# EasyEDA schematic SCH_Moses-Mini_2025-01-24.json
TITLE: Sheet_1; REV: 1.0; Date: 2025-01-20; Sheet: 1/1; Drawn By: augiekweston; Company: Your Company
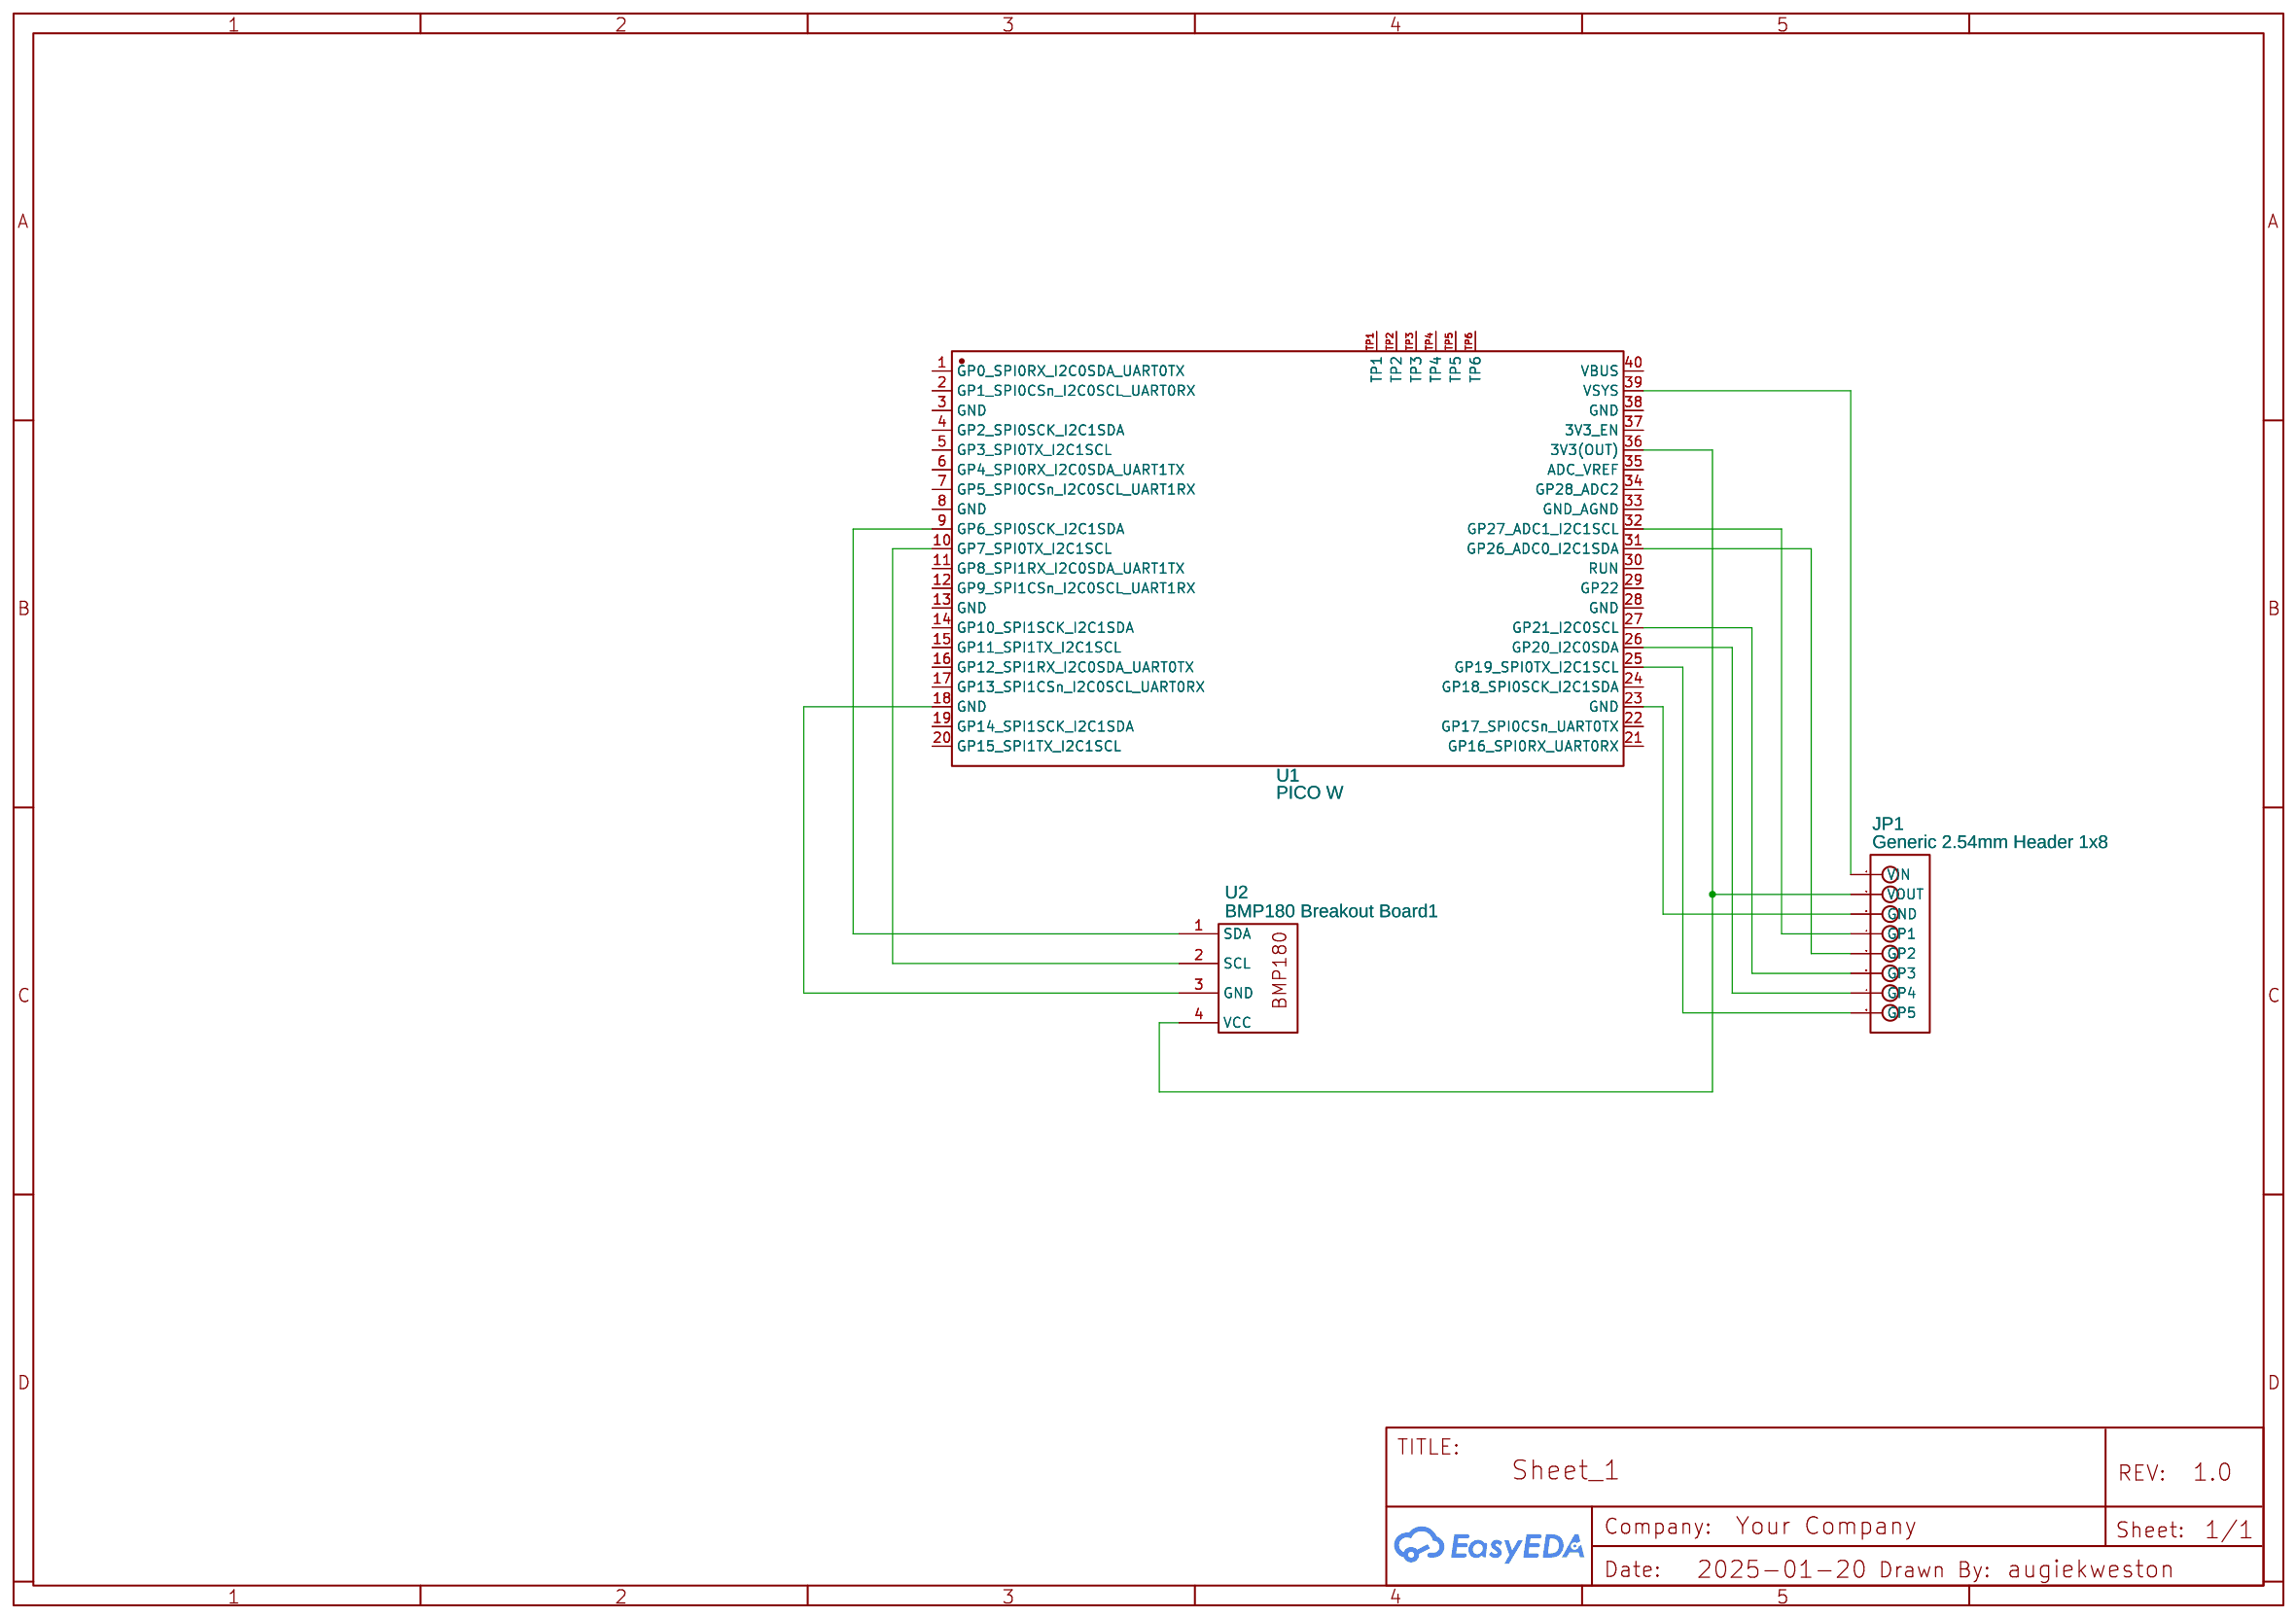
[diagram p0: schematic sheet]

## Parts
JP1  Generic 2.54mm Header 1x8  [GENERIC 2.54MM HEADER 1X8]
U1  PICO W  [COMM-SMD_L51.0-W21.0-P2.54_PICOW]
U2  BMP180 Breakout Board1  [BMP180]

## Library data of the parts
JP1 = Generic 2.54mm Header 1x8: Contributor: danagould
U1 = PICO W: Supplier: LCSC; Supplier Part: C7203003; Manufacturer: Raspberry Pi(树莓派); Contributor: lcsc; JLCPCB Part Class: Extended Part
U2 = BMP180 Breakout Board1: Contributor: Melone44

## Nets
Net-(JP1-1): JP1.1(VIN) U1.39(VSYS)
Net-(JP1-2): JP1.2(VOUT) U1.36(3V3(OUT)) U2.4(VCC)
Net-(JP1-3): JP1.3(GND) U1.23(GND)
Net-(JP1-4): JP1.4(GP1) U1.32(GP27_ADC1_I2C1SCL)
Net-(JP1-5): JP1.5(GP2) U1.31(GP26_ADC0_I2C1SDA)
Net-(JP1-6): JP1.6(GP3) U1.27(GP21_I2C0SCL)
Net-(JP1-7): JP1.7(GP4) U1.26(GP20_I2C0SDA)
Net-(JP1-8): JP1.8(GP5) U1.25(GP19_SPI0TX_I2C1SCL)
Net-(U1-9): U1.9(GP6_SPI0SCK_I2C1SDA) U2.1(SDA)
Net-(U1-10): U1.10(GP7_SPI0TX_I2C1SCL) U2.2(SCL)
Net-(U1-18): U1.18(GND) U2.3(GND)

Not connected (* = marked no-connect by the designer): U1 1(GP0_SPI0RX_I2C0SDA_UART0TX) 2(GP1_SPI0CSn_I2C0SCL_UART0RX) 3(GND) 4(GP2_SPI0SCK_I2C1SDA) 5(GP3_SPI0TX_I2C1SCL) 6(GP4_SPI0RX_I2C0SDA_UART1TX) 7(GP5_SPI0CSn_I2C0SCL_UART1RX) 8(GND) 11(GP8_SPI1RX_I2C0SDA_UART1TX) 12(GP9_SPI1CSn_I2C0SCL_UART1RX) 13(GND) 14(GP10_SPI1SCK_I2C1SDA) 15(GP11_SPI1TX_I2C1SCL) 16(GP12_SPI1RX_I2C0SDA_UART0TX) 17(GP13_SPI1CSn_I2C0SCL_UART0RX) 19(GP14_SPI1SCK_I2C1SDA) 20(GP15_SPI1TX_I2C1SCL) 21(GP16_SPI0RX_UART0RX) 22(GP17_SPI0CSn_UART0TX) 24(GP18_SPI0SCK_I2C1SDA) 28(GND) 29(GP22) 30(RUN) 33(GND_AGND) 34(GP28_ADC2) 35(ADC_VREF) 37(3V3_EN) 38(GND) 40(VBUS) TP1 TP2 TP3 TP4 TP5 TP6
